# Altium schematic sheet PowerSwitch_P12V.SchDoc: 3.3V Load Switch
size 431 x 279 mm; DocumentNumber: 7; SheetNumber: 7; SheetTotal: 18; ENG_APP_DATE: --/--/--; DSN_APP_DATE: --/--/--; CHK_APP_DATE: --/--/--
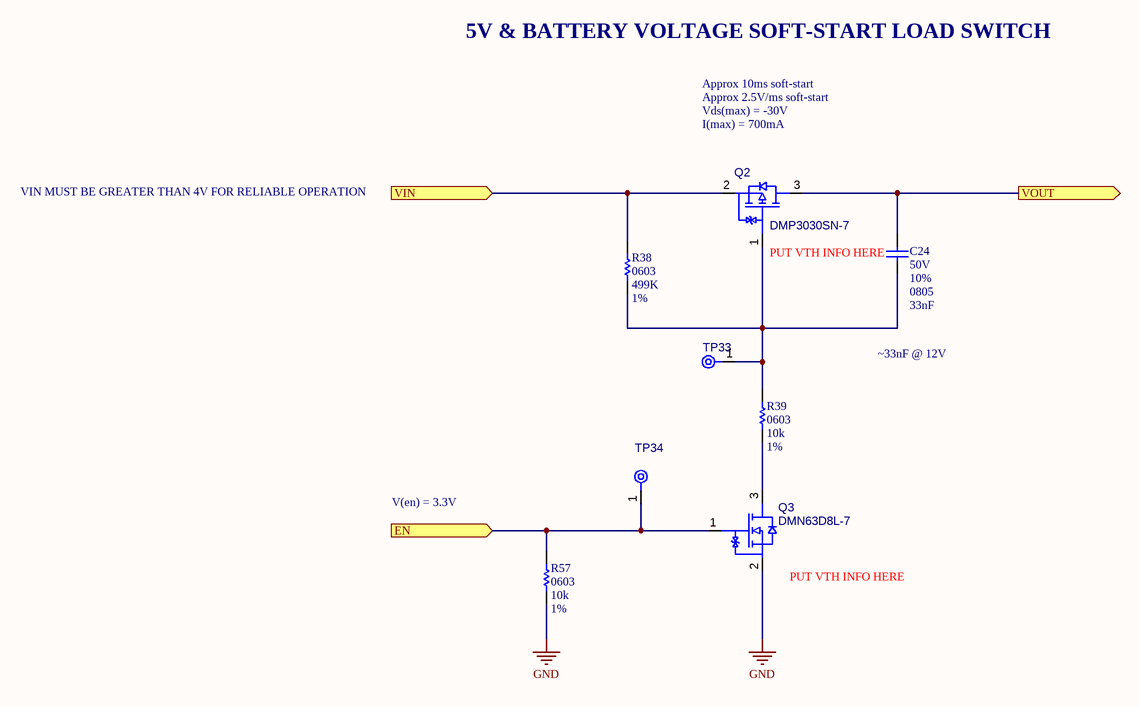
[diagram p0: PowerSwitch_P12V.SchDoc]

## Parts
C24  value 33nF  Voltage Rating: 50V  Tolerance: 10%  Case/Package: 0805  [CAPC2013X95X50ML10T25]  (hidden comment: Capacitor 33nF 10%, 50V, X7R, 0805)
Q2  DMP3030SN-7  [SOT95P164X140-3M]
Q3  DMN63D8L-7  [SOT95P240X110-3M]
R38  value 499K  Case/Package: 0603  Tolerance: 1%  [RESC1609X50X30ML08T20]  (hidden comment: Resistor 499K +/-1% 0603 100 mW)
R39  value 10k  Case/Package: 0603  Tolerance: 1%  [RESC1608X55X25ML10T15]  (hidden comment: Resistor 10k +/-1% 0603 100 mW)
R57  value 10k  Case/Package: 0603  Tolerance: 1%  [RESC1608X55X25ML10T15]  (hidden comment: Resistor 10k +/-1% 0603 100 mW)
TP33  TPAD6R-CIRCLED  [TP06R - Circled]  (value not drawn)  (no BOM)
TP34  TPAD6R-CIRCLED  [TP06R - Circled]  (value not drawn)  (no BOM)

## Ports
EN (in), VIN (in), VOUT (out)

## Nets
GND: Q3.2(S) R57.1
EN: Q3.1(G) R57.2 TP34.1(TP) ; port EN
VIN: Q2.2(S) R38.2 ; port VIN
VOUT: C24.2 Q2.3(D) ; port VOUT
NetC24_1: C24.1 Q2.1(G) R38.1 R39.2 TP33.1(TP)
NetQ3_3: Q3.3(D) R39.1

## Notes on the sheet
- 5V & BATTERY VOLTAGE SOFT-START LOAD SWITCH
- Approx 10ms soft-start
- Approx 2.5V/ms soft-start
- Vds(max) = -30V
- I(max) = 700mA
- VIN MUST BE GREATER THAN 4V FOR RELIABLE OPERATION
- (near Q2) PUT VTH INFO HERE
- ~33nF @ 12V
- V(en) = 3.3V
- (near Q3) PUT VTH INFO HERE
- THIS DOCUMENT AND THE DATA DISCLOSED HEREIN OR HEREWITH IS THE PROPERTY OF APPLIED PHYSICS LAB - UNIVERSITY OF WASHINGTON.
- PROJECT
- TITLE
- FILE NAME
- SIZE
- B
- CAGE CODE
- DWG NO.
- SHEET
- OF
- REV

## Library data of the parts
C24 = CMP-001-00133-11: Chip Capacitor, 33nF, 10%, 50 V, X7R 0805 (2012 Metric); Capacitor Type: Ceramic; Decade: 10nF; Capacitance: 33nF; Pins: 2; RoHS Compliant: True; Min Operating Temperature: -55°C; Max Operating Temperature: 125°C; Dielectric: X7R; Mount: Surface Mount
Q2 = CMP-013-00050-4: Trans Mosfet P-ch 30V 0.7A 3-PIN SC-59 T/r / Mosfet P-ch 30V 700MA SC59-3; Drain to Source Breakdown Voltage: -30V; Polarity: P-CHANNEL; Max Power Dissipation: 500mW; Rds On Max: 250mR; Transistor Type: PMOS; Min Operating Temperature: -65°C; Power Dissipation: 500mW; Case/Package: SOT-23-3; Max Operating Temperature: 150°C; Mount: Surface Mount
Q3 = CMP-013-00051-2: Trans Mosfet N-ch 30V 0.35A 3-PIN SOT-23 T/r; Rds On Max: 2.8R; Max Power Dissipation: 350mW; Continuous Drain Current (ID): 350mA; Transistor Type: NMOS; Drain to Source Voltage (Vdss): 30V; Max Operating Temperature: 150°C; Mount: Surface Mount; Min Operating Temperature: -55°C; Case/Package: SOT-23-3
R38 = CMP-009-01036-2: Chip Resistor, 499k Ohm, +/- 1%, 0.1 W, -55 to 155 degC, 0603 (1608 Metric); Power: 100mW; Voltage Rating: 75V; Decade: 100k; RoHS Compliant: Yes; Max Operating Temperature: 155°C; Min Operating Temperature: -55°C; Pins: 2; Mount: Surface Mount
R39 R57 = CMP-009-00017-8: Chip Resistor, 10 KOhm, +/- 1%, 01 W, -55 to 155 degC, 0603 (1608 Metric); Power: 100mW; Voltage Rating: 50V; RoHS Compliant: True; Max Operating Temperature: 155°C; Min Operating Temperature: -55°C; Pins: 2; Decade: 10k; Mount: Surface Mount
TP33 TP34 = CMP-00028-00014-3: 0.6mm round with a silkscreen circle.; Pins: 1